# EAGLE design armstrap_eagle-tester_1.0.0 (EAGLE 6.6.0)
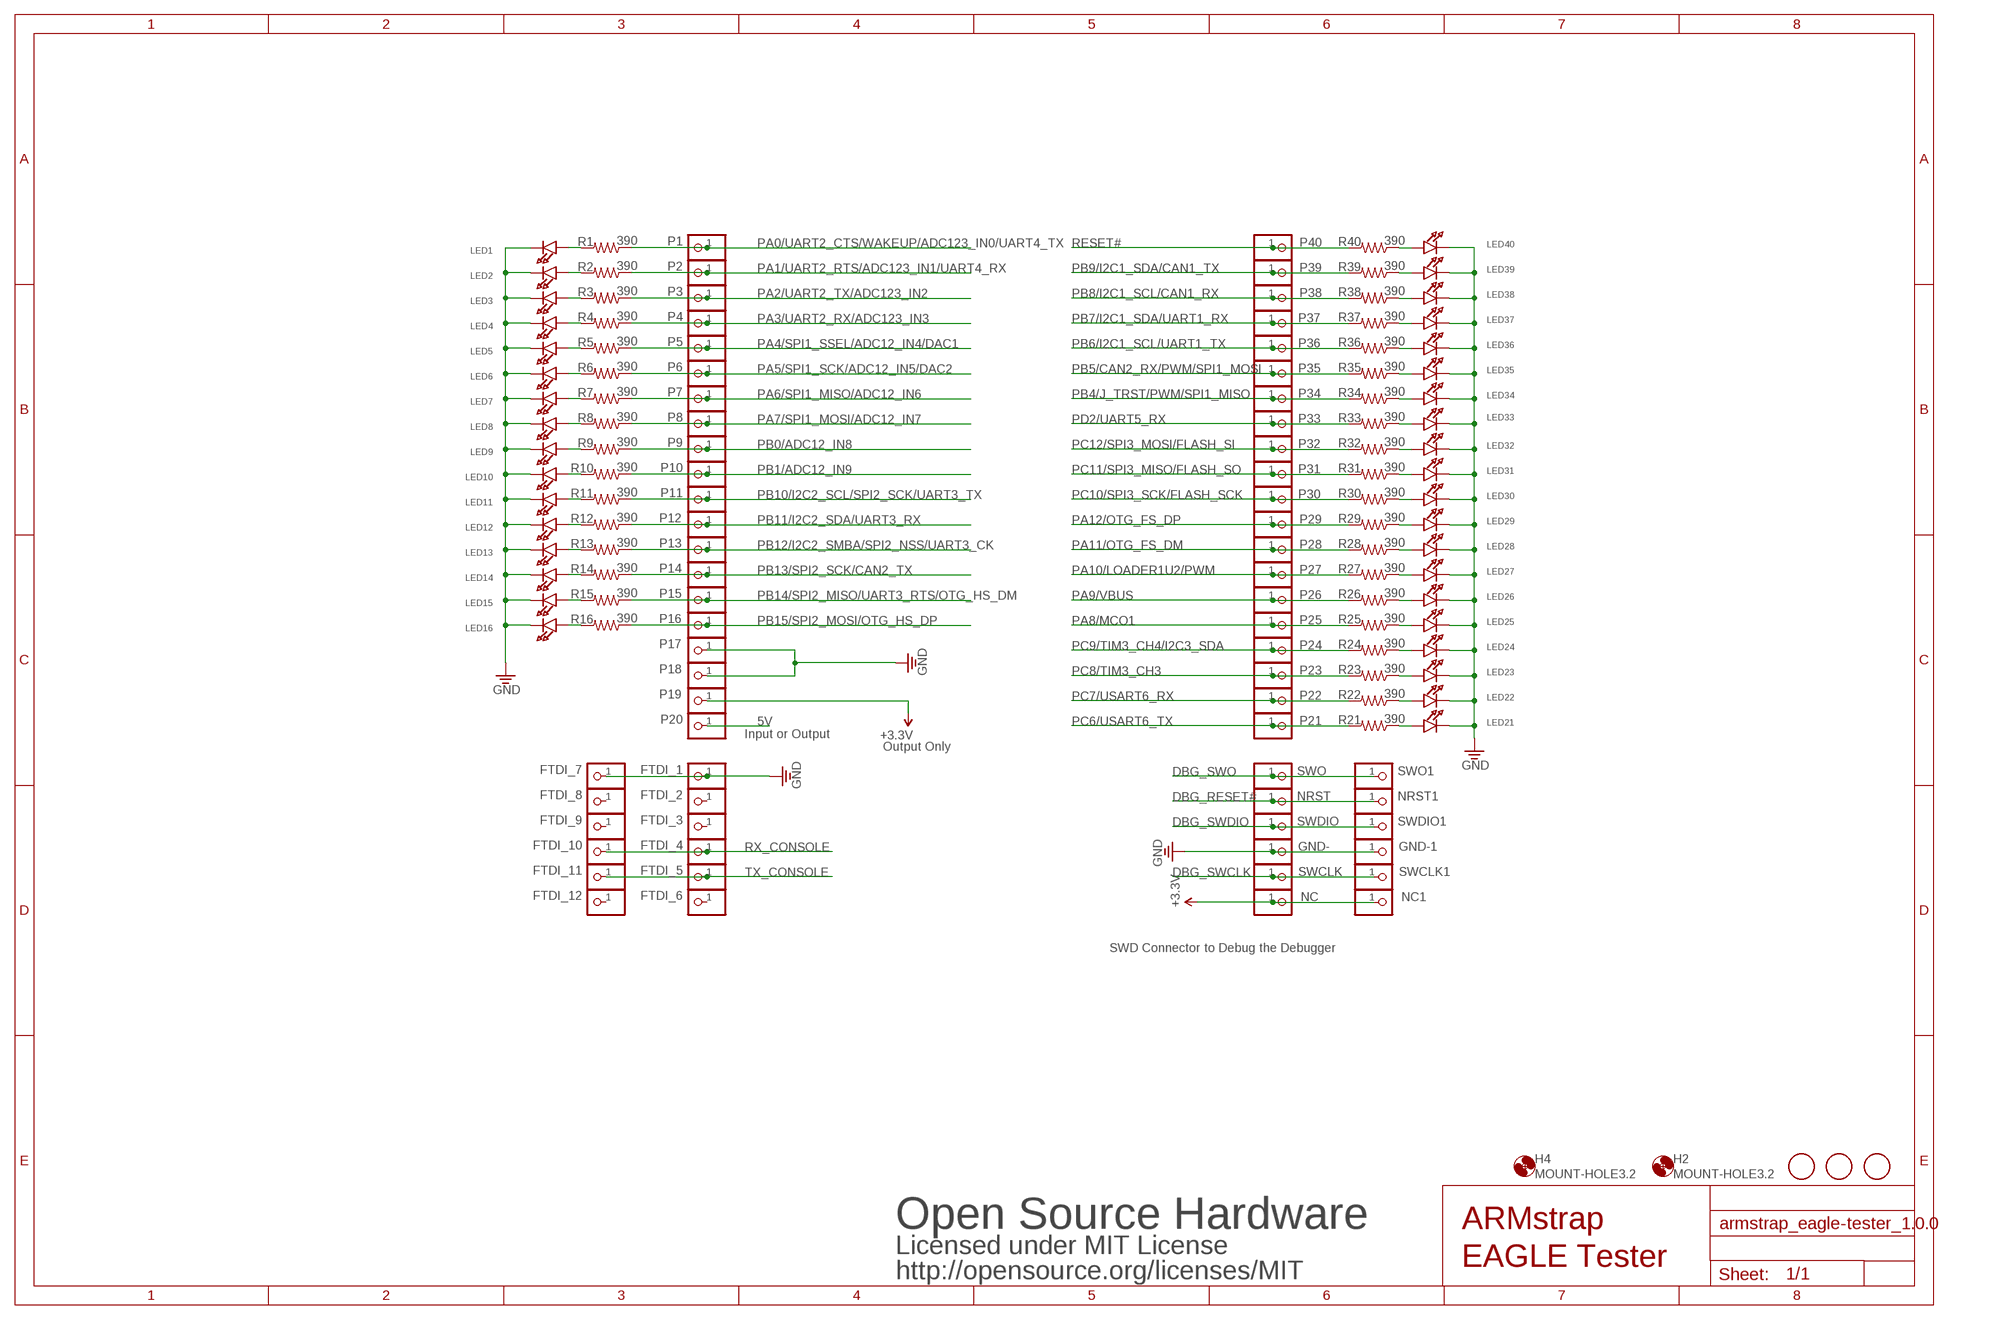
[diagram p0: schematic, sheet 1]

## Parts
FID2  FIDUCIAL  [FIDUCIAL_1MM]
FID3  FIDUCIAL  [FIDUCIAL_1MM]
FID4  FIDUCIAL  [FIDUCIAL_1MM]
FTDI_1  PINHD-1X1  [1X01]
FTDI_2  PINHD-1X1  [1X01]
FTDI_3  PINHD-1X1  [1X01]
FTDI_4  PINHD-1X1  [1X01]
FTDI_5  PINHD-1X1  [1X01]
FTDI_6  PINHD-1X1  [1X01]
FTDI_7  PINHD-1X1  [1X01]
FTDI_8  PINHD-1X1  [1X01]
FTDI_9  PINHD-1X1  [1X01]
FTDI_10  PINHD-1X1  [1X01]
FTDI_11  PINHD-1X1  [1X01]
FTDI_12  PINHD-1X1  [1X01]
GND-  PINHD-1X1  [1X01]
GND-1  PINHD-1X1  [1X01]
H2  MOUNT-HOLE3.2  [3,2]
H4  MOUNT-HOLE3.2  [3,2]
LED1  APT3216QBC/D  LED1206  [CHIPLED_1206]
LED2  APT3216QBC/D  LED1206  [CHIPLED_1206]
LED3  APT3216QBC/D  LED1206  [CHIPLED_1206]
LED4  APT3216QBC/D  LED1206  [CHIPLED_1206]
LED5  APT3216QBC/D  LED1206  [CHIPLED_1206]
LED6  APT3216QBC/D  LED1206  [CHIPLED_1206]
LED7  APT3216QBC/D  LED1206  [CHIPLED_1206]
LED8  APT3216QBC/D  LED1206  [CHIPLED_1206]
LED9  APT3216QBC/D  LED1206  [CHIPLED_1206]
LED10  APT3216QBC/D  LED1206  [CHIPLED_1206]
LED11  APT3216QBC/D  LED1206  [CHIPLED_1206]
LED12  APT3216QBC/D  LED1206  [CHIPLED_1206]
LED13  APT3216QBC/D  LED1206  [CHIPLED_1206]
LED14  APT3216QBC/D  LED1206  [CHIPLED_1206]
LED15  APT3216QBC/D  LED1206  [CHIPLED_1206]
LED16  APT3216QBC/D  LED1206  [CHIPLED_1206]
LED21  APT3216QBC/D  LED1206  [CHIPLED_1206]
LED22  APT3216QBC/D  LED1206  [CHIPLED_1206]
LED23  APT3216QBC/D  LED1206  [CHIPLED_1206]
LED24  APT3216QBC/D  LED1206  [CHIPLED_1206]
LED25  APT3216QBC/D  LED1206  [CHIPLED_1206]
LED26  APT3216QBC/D  LED1206  [CHIPLED_1206]
LED27  APT3216QBC/D  LED1206  [CHIPLED_1206]
LED28  APT3216QBC/D  LED1206  [CHIPLED_1206]
LED29  APT3216QBC/D  LED1206  [CHIPLED_1206]
LED30  APT3216QBC/D  LED1206  [CHIPLED_1206]
LED31  APT3216QBC/D  LED1206  [CHIPLED_1206]
LED32  APT3216QBC/D  LED1206  [CHIPLED_1206]
LED33  APT3216QBC/D  LED1206  [CHIPLED_1206]
LED34  APT3216QBC/D  LED1206  [CHIPLED_1206]
LED35  APT3216QBC/D  LED1206  [CHIPLED_1206]
LED36  APT3216QBC/D  LED1206  [CHIPLED_1206]
LED37  APT3216QBC/D  LED1206  [CHIPLED_1206]
LED38  APT3216QBC/D  LED1206  [CHIPLED_1206]
LED39  APT3216QBC/D  LED1206  [CHIPLED_1206]
LED40  APT3216QBC/D  LED1206  [CHIPLED_1206]
NC  PINHD-1X1  [1X01]
NC1  PINHD-1X1  [1X01]
NRST  PINHD-1X1  [1X01]
NRST1  PINHD-1X1  [1X01]
P1  PINHD-1X1  [1X01]
P2  PINHD-1X1  [1X01]
P3  PINHD-1X1  [1X01]
P4  PINHD-1X1  [1X01]
P5  PINHD-1X1  [1X01]
P6  PINHD-1X1  [1X01]
P7  PINHD-1X1  [1X01]
P8  PINHD-1X1  [1X01]
P9  PINHD-1X1  [1X01]
P10  PINHD-1X1  [1X01]
P11  PINHD-1X1  [1X01]
P12  PINHD-1X1  [1X01]
P13  PINHD-1X1  [1X01]
P14  PINHD-1X1  [1X01]
P15  PINHD-1X1  [1X01]
P16  PINHD-1X1  [1X01]
P17  PINHD-1X1  [1X01]
P18  PINHD-1X1  [1X01]
P19  PINHD-1X1  [1X01]
P20  PINHD-1X1  [1X01]
P21  PINHD-1X1  [1X01]
P22  PINHD-1X1  [1X01]
P23  PINHD-1X1  [1X01]
P24  PINHD-1X1  [1X01]
P25  PINHD-1X1  [1X01]
P26  PINHD-1X1  [1X01]
P27  PINHD-1X1  [1X01]
P28  PINHD-1X1  [1X01]
P29  PINHD-1X1  [1X01]
P30  PINHD-1X1  [1X01]
P31  PINHD-1X1  [1X01]
P32  PINHD-1X1  [1X01]
P33  PINHD-1X1  [1X01]
P34  PINHD-1X1  [1X01]
P35  PINHD-1X1  [1X01]
P36  PINHD-1X1  [1X01]
P37  PINHD-1X1  [1X01]
P38  PINHD-1X1  [1X01]
P39  PINHD-1X1  [1X01]
P40  PINHD-1X1  [1X01]
R1  390  RES0805  [0805]
R2  390  RES0805  [0805]
R3  390  RES0805  [0805]
R4  390  RES0805  [0805]
R5  390  RES0805  [0805]
R6  390  RES0805  [0805]
R7  390  RES0805  [0805]
R8  390  RES0805  [0805]
R9  390  RES0805  [0805]
R10  390  RES0805  [0805]
R11  390  RES0805  [0805]
R12  390  RES0805  [0805]
R13  390  RES0805  [0805]
R14  390  RES0805  [0805]
R15  390  RES0805  [0805]
R16  390  RES0805  [0805]
R21  390  RES0805  [0805]
R22  390  RES0805  [0805]
R23  390  RES0805  [0805]
R24  390  RES0805  [0805]
R25  390  RES0805  [0805]
R26  390  RES0805  [0805]
R27  390  RES0805  [0805]
R28  390  RES0805  [0805]
R29  390  RES0805  [0805]
R30  390  RES0805  [0805]
R31  390  RES0805  [0805]
R32  390  RES0805  [0805]
R33  390  RES0805  [0805]
R34  390  RES0805  [0805]
R35  390  RES0805  [0805]
R36  390  RES0805  [0805]
R37  390  RES0805  [0805]
R38  390  RES0805  [0805]
R39  390  RES0805  [0805]
R40  390  RES0805  [0805]
SWCLK  PINHD-1X1  [1X01]
SWCLK1  PINHD-1X1  [1X01]
SWDIO  PINHD-1X1  [1X01]
SWDIO1  PINHD-1X1  [1X01]
SWO  PINHD-1X1  [1X01]
SWO1  PINHD-1X1  [1X01]

## Nets
3.3V: NC1.1 NC.1 P19.1 ; supply symbol labelled +3.3V
5: LED5.A R5.2
5V: P20.1
11: LED11.A R11.2
DBG_RESET#: NRST1.1 NRST.1
DBG_SWCLK: SWCLK1.1 SWCLK.1
DBG_SWDIO: SWDIO1.1 SWDIO.1
DBG_SWO: SWO1.1 SWO.1
E2: LED2.A R2.2
GND [power]: FTDI_1.1 FTDI_7.1 GND-1.1 GND-.1 LED1.C LED2.C LED3.C LED4.C LED5.C LED6.C LED7.C LED8.C LED9.C LED10.C LED11.C LED12.C LED13.C LED14.C LED15.C LED16.C LED21.C LED22.C LED23.C LED24.C LED25.C LED26.C LED27.C LED28.C LED29.C LED30.C LED31.C LED32.C LED33.C LED34.C LED35.C LED36.C LED37.C LED38.C LED39.C LED40.C P17.1 P18.1
N$1: LED1.A R1.2
N$3: LED3.A R3.2
N$4: LED4.A R4.2
N$8: LED6.A R6.2
N$9: LED7.A R7.2
N$10: LED8.A R8.2
N$11: LED9.A R9.2
N$12: LED10.A R10.2
N$14: LED12.A R12.2
N$15: LED13.A R13.2
N$16: LED14.A R14.2
N$17: LED15.A R15.2
N$18: LED16.A R16.2
N$21: LED40.A R40.1
N$22: LED39.A R39.1
N$23: LED38.A R38.1
N$25: LED37.A R37.1
N$26: LED36.A R36.1
N$27: LED35.A R35.1
N$28: LED34.A R34.1
N$29: LED33.A R33.1
N$30: LED32.A R32.1
N$31: LED31.A R31.1
N$32: LED30.A R30.1
N$33: LED29.A R29.1
N$34: LED28.A R28.1
N$35: LED27.A R27.1
N$36: LED26.A R26.1
N$37: LED25.A R25.1
N$38: LED24.A R24.1
N$39: LED23.A R23.1
N$40: LED22.A R22.1
N$41: LED21.A R21.1
PA0/UART2_CTS/WAKEUP/ADC123_IN0/UART4_TX: P1.1 R1.1
PA1/UART2_RTS/ADC123_IN1/UART4_RX: P2.1 R2.1
PA2/UART2_TX/ADC123_IN2: P3.1 R3.1
PA3/UART2_RX/ADC123_IN3: P4.1 R4.1
PA4/SPI1_SSEL/ADC12_IN4/DAC1: P5.1 R5.1
PA5/SPI1_SCK/ADC12_IN5/DAC2: P6.1 R6.1
PA6/SPI1_MISO/ADC12_IN6: P7.1 R7.1
PA7/SPI1_MOSI/ADC12_IN7: P8.1 R8.1
PA8/MCO1: P25.1 R25.2
PA9/VBUS: P26.1 R26.2
PA10/LOADER1U2/PWM: P27.1 R27.2
PA11/OTG_FS_DM: P28.1 R28.2
PA12/OTG_FS_DP: P29.1 R29.2
PB0/ADC12_IN8: P9.1 R9.1
PB1/ADC12_IN9: P10.1 R10.1
PB4/J_TRST/PWM/SPI1_MISO: P34.1 R34.2
PB5/CAN2_RX/PWM/SPI1_MOSI: P35.1 R35.2
PB6/I2C1_SCL/UART1_TX: P36.1 R36.2
PB7/I2C1_SDA/UART1_RX: P37.1 R37.2
PB8/I2C1_SCL/CAN1_RX: P38.1 R38.2
PB9/I2C1_SDA/CAN1_TX: P39.1 R39.2
PB10/I2C2_SCL/SPI2_SCK/UART3_TX: P11.1 R11.1
PB11/I2C2_SDA/UART3_RX: P12.1 R12.1
PB12/I2C2_SMBA/SPI2_NSS/UART3_CK: P13.1 R13.1
PB13/SPI2_SCK/CAN2_TX: P14.1 R14.1
PB14/SPI2_MISO/UART3_RTS/OTG_HS_DM: P15.1 R15.1
PB15/SPI2_MOSI/OTG_HS_DP: P16.1 R16.1
PC6/USART6_TX: P21.1 R21.2
PC7/USART6_RX: P22.1 R22.2
PC8/TIM3_CH3: P23.1 R23.2
PC9/TIM3_CH4/I2C3_SDA: P24.1 R24.2
PC10/SPI3_SCK/FLASH_SCK: P30.1 R30.2
PC11/SPI3_MISO/FLASH_SO: P31.1 R31.2
PC12/SPI3_MOSI/FLASH_SI: P32.1 R32.2
PD2/UART5_RX: P33.1 R33.2
RESET#: P40.1 R40.2
RX_CONSOLE: FTDI_4.1 FTDI_10.1
TX_CONSOLE: FTDI_5.1 FTDI_11.1
Unconnected: FTDI_2.1 FTDI_3.1 FTDI_6.1 FTDI_8.1 FTDI_9.1 FTDI_12.1

## Notes on the sheet
- Input or Output
- Output Only
- SWD Connector to Debug the Debugger
- Open Source Hardware | ARMstrap
- Licensed under MIT License
- EAGLE Tester
- http://opensource.org/licenses/MIT

## Library data of the parts
FID2-FID4 = vovtech:FIDUCIAL: For use by pick and place machines to calibrate the vision/machine, 1mm By microbuilder.eu
FTDI_1-FTDI_12 GND- GND-1 NC NC1 NRST NRST1 P1-P40 SWCLK SWCLK1 SWDIO SWDIO1 SWO SWO1 = pinhead:PINHD-1X1: PIN HEADER
H2 H4 = vovtech:MOUNT-HOLE: MOUNTING HOLE with drill center marker
LED1-LED16 LED21-LED40 = vovtech:LED: LED 0603 - 0603 Surface Mount Package Green LED - Low Power (3.9mcd, 2ma, 1.7Vf) Orange LED - Low Power (9.8mcd, 2ma, 1.8Vf) Red LED - Low Power (5mcd, 2ma, 1.8Vf) Yellow LED - Low Power (7mcd, 2ma, 1.8Vf) 0805 - 0805 Surface Mount Package 20mA: Red LED (104mcd, 20mA, Diffused) - LS R976 [Digikey: 475-1278-6-ND] Red LED (12mcd, 20mA, 2.0Vf, Clear) - APT2012EC [Digikey: 754-1128-1-ND] Green LED (15mcd, 20mA, 2.2Vf, Clear) - APT2012GC [Digikey: 754-1131-1-ND] Orange LED (160mcd, 20mA, 2.1Vf, Clear) - APT2012SECK [Digikey: 754-1130-1-ND] 2mA: Red LED (8.8mcd, 2mA, 1.8Vf, Clear) - Low Power [Digikey: 475-2510-1-ND] Green LED (5mcd, 2mA, 1.8Vf, Clear) - Low Power [Digikey: 475-2730-1-ND] Yellow LED (11.3mcd, 2mA, 1.8Vf, Clear) - Low Power [Digikey: 475-2555-1-ND] 1206 - 1206 Surface Mount Package Green LED (26mcd, 20mA, Diffused) - LG N971 [Digikey: 475-1407-6-ND] Red LED (15mcd, 20mA, Diffused) - LH N974 [Digikey: 475-1416-6-ND]
R1-R16 R21-R40 = vovtech:RES: Resistor

## Board
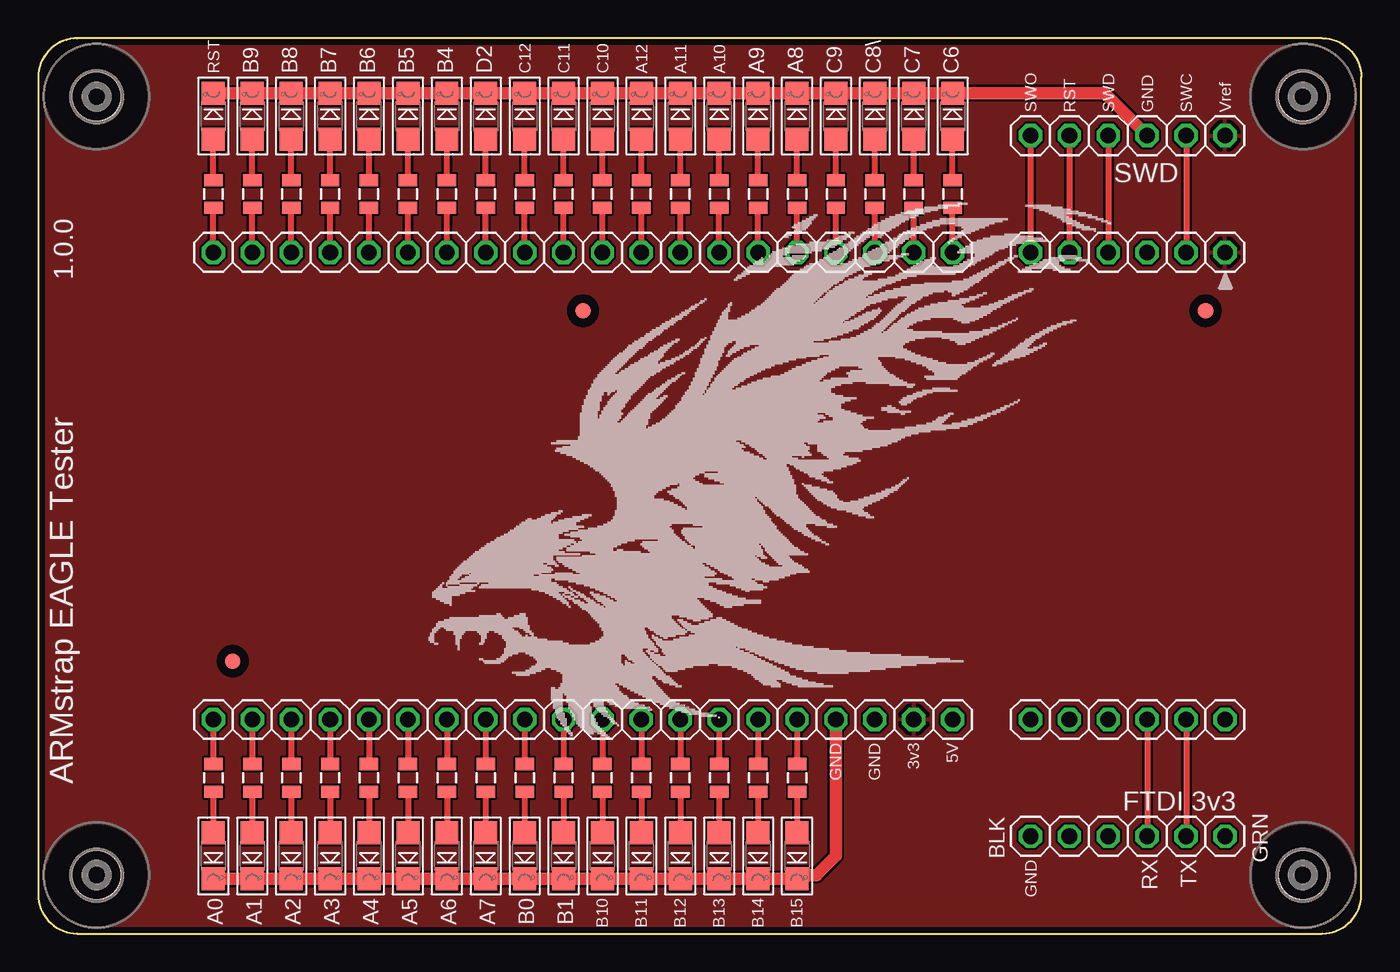
[diagram p1: board, top side]
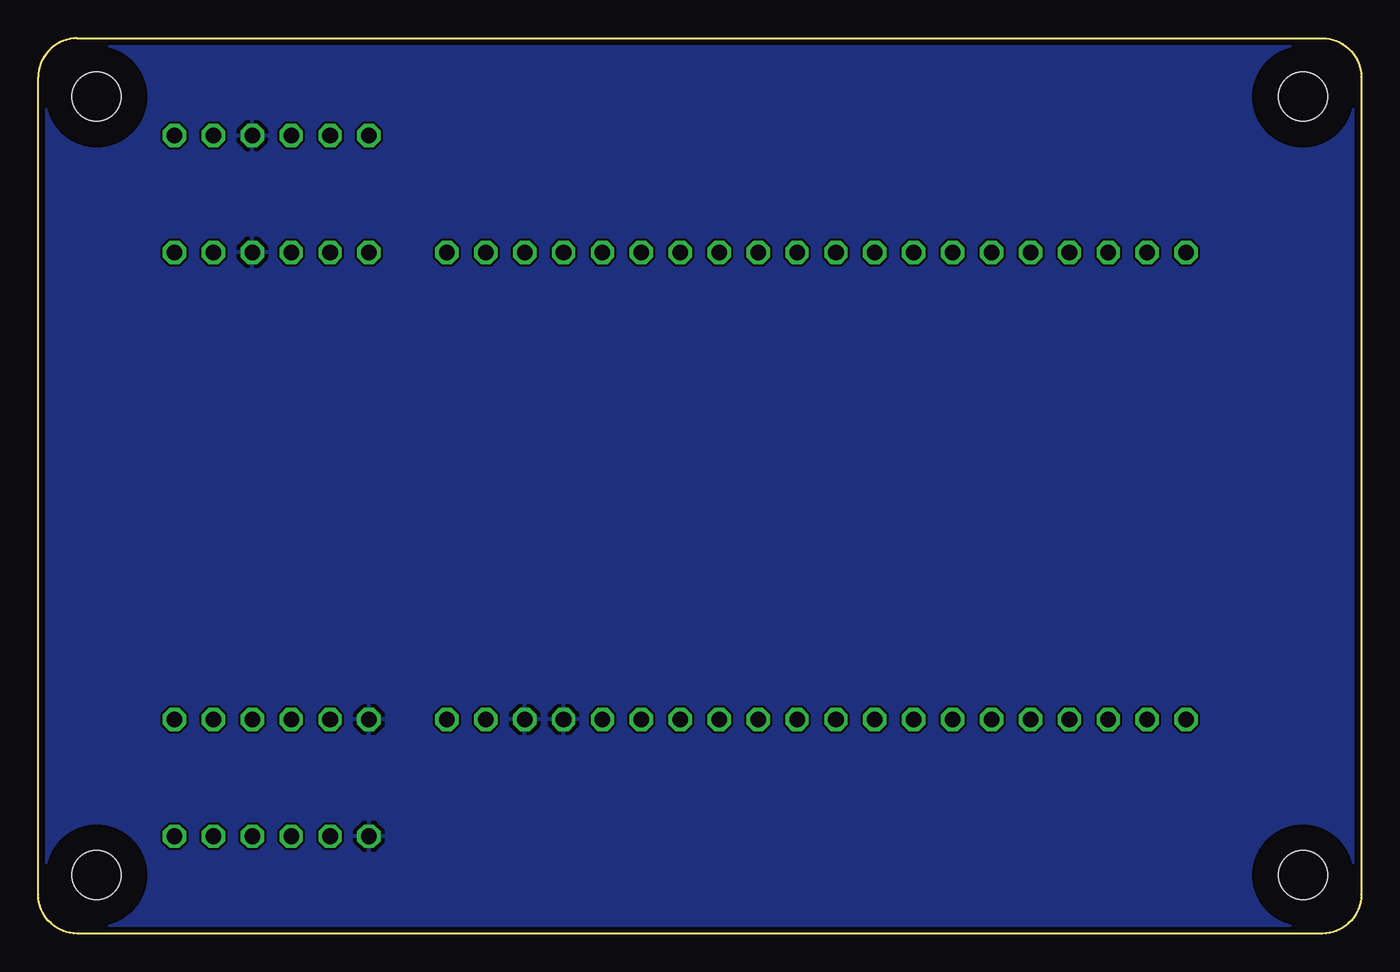
[diagram p2: board, bottom side, seen from below]

Size 86.36 x 58.42 mm. Coordinates in mm from the lower left corner, seen from the top.
Outline: 2.54,0 83.82,0 arc90 86.36,2.54 86.36,55.88 arc90 83.82,58.42 2.54,58.42 arc90 0,55.88 0,2.54 arc90 2.54,0
Copper layers (1*16): Top 0.0356mm / dielectric 1.5011mm / Bottom 0.0356mm
Design rules "LaenPCBOrder *": minimum track width 6mil, minimum drill 13mil, track to track 6mil, track to pad 6mil, pad to pad 6mil, via to via 6mil, smd to smd 6mil, copper to edge 15mil, drill to drill 6mil, minimum pad ring 7mil, minimum via ring 7mil, stop-mask expansion 4mil, vias tented up to drill 16mil, thermal gap 10mil

### Footprints (pad centres in the part's own frame; a part is rotated, then mirrored left to right if it is on the bottom)
FIDUCIAL_1MM = smd 1 x 1: 1 0,0
1X01 = drill 1.016 octagon: 1 0,0
3,2 = hole 3.2: 0,0
CHIPLED_1206 = smd 1.5 x 1.5: A 1.496,0; C -1.496,0
0805 = smd 0.8 x 1.2: 1 -0.9,0; 2 0.9,0

### Placement (x,y rotation side)
FID2  76.2,40.64 0 top
FID3  12.7,17.78 0 top
FID4  35.56,40.64 0 top
FTDI_1  64.77,13.97 0 top
FTDI_2  67.31,13.97 0 top
FTDI_3  69.85,13.97 0 top
FTDI_4  72.39,13.97 0 top
FTDI_5  74.93,13.97 0 top
FTDI_6  77.47,13.97 0 top
FTDI_7  64.77,6.35 90 top
FTDI_8  67.31,6.35 90 top
FTDI_9  69.85,6.35 90 top
FTDI_10  72.39,6.35 90 top
FTDI_11  74.93,6.35 90 top
FTDI_12  77.47,6.35 90 top
GND-  72.39,44.45 0 top
GND-1  72.39,52.07 90 top
H1  MOUNT-HOLE3.2  [3,2]  82.55,54.61 0 top
H2  82.55,3.81 0 top
H3  MOUNT-HOLE3.2  [3,2]  3.81,54.61 0 top
H4  3.81,3.81 0 top
LED1  11.43,5.08 90 top
LED2  13.97,5.08 90 top
LED3  16.51,5.08 90 top
LED4  19.05,5.08 90 top
LED5  21.59,5.08 90 top
LED6  24.13,5.08 90 top
LED7  26.67,5.08 90 top
LED8  29.21,5.08 90 top
LED9  31.75,5.08 90 top
LED10  34.29,5.08 90 top
LED11  36.83,5.08 90 top
LED12  39.37,5.08 90 top
LED13  41.91,5.08 90 top
LED14  44.45,5.08 90 top
LED15  46.99,5.08 90 top
LED16  49.53,5.08 90 top
LED21  59.69,53.34 270 top
LED22  57.15,53.34 270 top
LED23  54.61,53.34 270 top
LED24  52.07,53.34 270 top
LED25  49.53,53.34 270 top
LED26  46.99,53.34 270 top
LED27  44.45,53.34 270 top
LED28  41.91,53.34 270 top
LED29  39.37,53.34 270 top
LED30  36.83,53.34 270 top
LED31  34.29,53.34 270 top
LED32  31.75,53.34 270 top
LED33  29.21,53.34 270 top
LED34  26.67,53.34 270 top
LED35  24.13,53.34 270 top
LED36  21.59,53.34 270 top
LED37  19.05,53.34 270 top
LED38  16.51,53.34 270 top
LED39  13.97,53.34 270 top
LED40  11.43,53.34 270 top
NC  77.47,44.45 0 top
NC1  77.47,52.07 90 top
NRST  67.31,44.45 0 top
NRST1  67.31,52.07 90 top
P1  11.43,13.97 0 top
P2  13.97,13.97 90 top
P3  16.51,13.97 90 top
P4  19.05,13.97 90 top
P5  21.59,13.97 90 top
P6  24.13,13.97 90 top
P7  26.67,13.97 90 top
P8  29.21,13.97 90 top
P9  31.75,13.97 90 top
P10  34.29,13.97 90 top
P11  36.83,13.97 90 top
P12  39.37,13.97 90 top
P13  41.91,13.97 90 top
P14  44.45,13.97 90 top
P15  46.99,13.97 90 top
P16  49.53,13.97 90 top
P17  52.07,13.97 90 top
P18  54.61,13.97 90 top
P19  57.15,13.97 90 top
P20  59.69,13.97 90 top
P21  59.69,44.45 0 top
P22  57.15,44.45 0 top
P23  54.61,44.45 0 top
P24  52.07,44.45 0 top
P25  49.53,44.45 0 top
P26  46.99,44.45 0 top
P27  44.45,44.45 0 top
P28  41.91,44.45 0 top
P29  39.37,44.45 0 top
P30  36.83,44.45 0 top
P31  34.29,44.45 0 top
P32  31.75,44.45 0 top
P33  29.21,44.45 0 top
P34  26.67,44.45 0 top
P35  24.13,44.45 0 top
P36  21.59,44.45 0 top
P37  19.05,44.45 0 top
P38  16.51,44.45 0 top
P39  13.97,44.45 0 top
P40  11.43,44.45 0 top
R1  11.43,10.16 270 top
R2  13.97,10.16 270 top
R3  16.51,10.16 270 top
R4  19.05,10.16 270 top
R5  21.59,10.16 270 top
R6  24.13,10.16 270 top
R7  26.67,10.16 270 top
R8  29.21,10.16 270 top
R9  31.75,10.16 270 top
R10  34.29,10.16 270 top
R11  36.83,10.16 270 top
R12  39.37,10.16 270 top
R13  41.91,10.16 270 top
R14  44.45,10.16 270 top
R15  46.99,10.16 270 top
R16  49.53,10.16 270 top
R21  59.69,48.26 270 top
R22  57.15,48.26 270 top
R23  54.61,48.26 270 top
R24  52.07,48.26 270 top
R25  49.53,48.26 270 top
R26  46.99,48.26 270 top
R27  44.45,48.26 270 top
R28  41.91,48.26 270 top
R29  39.37,48.26 270 top
R30  36.83,48.26 270 top
R31  34.29,48.26 270 top
R32  31.75,48.26 270 top
R33  29.21,48.26 270 top
R34  26.67,48.26 270 top
R35  24.13,48.26 270 top
R36  21.59,48.26 270 top
R37  19.05,48.26 270 top
R38  16.51,48.26 270 top
R39  13.97,48.26 270 top
R40  11.43,48.26 270 top
SWCLK  74.93,44.45 0 top
SWCLK1  74.93,52.07 90 top
SWDIO  69.85,44.45 0 top
SWDIO1  69.85,52.07 90 top
SWO  64.77,44.45 0 top
SWO1  64.77,52.07 0 top

### Tracks (layer width: path | path; a pad name or v marks a point on that pad's centre or on a via)
3.3V
  pour Top: -0.76,59.69 86.11,59.69 86.11,-1.27 0,-1.27
5
  Top 0.406: R5.2 LED5.A
11
  Top 0.406: R11.2 LED11.A
DBG_RESET#
  Top 0.406: NRST1.1 NRST.1
DBG_SWCLK
  Top 0.406: SWCLK1.1 SWCLK.1
DBG_SWDIO
  Top 0.406: SWDIO1.1 SWDIO.1
DBG_SWO
  Top 0.203: SWO.1 64.74,44.42
  Top 0.406: SWO1.1 SWO.1
E2
  Top 0.406: R2.2 LED2.A
GND
  Top 0.813: LED1.C LED2.C LED3.C LED4.C LED5.C LED6.C LED7.C LED8.C LED9.C LED10.C LED11.C LED12.C LED13.C LED14.C LED15.C LED16.C 49.76,3.81 50.8,3.81 52.07,5.08 P17.1 | LED40.C LED39.C LED38.C LED37.C LED36.C LED35.C LED34.C LED33.C LED32.C LED31.C LED30.C LED29.C LED28.C LED27.C LED26.C LED25.C LED24.C LED23.C LED22.C LED21.C 69.62,54.84 GND-1.1
  pour Bottom (rank 2): 86.41,59.23 86.41,-0.41 0.2,-0.41 0.2,59.23
N$1
  Top 0.406: R1.2 LED1.A
N$3
  Top 0.406: R3.2 LED3.A
N$4
  Top 0.406: R4.2 LED4.A
N$8
  Top 0.406: R6.2 LED6.A
N$9
  Top 0.406: R7.2 LED7.A
N$10
  Top 0.406: R8.2 LED8.A
N$11
  Top 0.406: R9.2 LED9.A
N$12
  Top 0.406: R10.2 LED10.A
N$14
  Top 0.406: R12.2 LED12.A
N$15
  Top 0.406: R13.2 LED13.A
N$16
  Top 0.406: R14.2 LED14.A
N$17
  Top 0.406: R15.2 LED15.A
N$18
  Top 0.406: R16.2 LED16.A
N$21
  Top 0.406: R40.1 LED40.A
N$22
  Top 0.406: R39.1 LED39.A
N$23
  Top 0.406: R38.1 LED38.A
N$25
  Top 0.406: R37.1 LED37.A
N$26
  Top 0.406: R36.1 LED36.A
N$27
  Top 0.406: R35.1 LED35.A
N$28
  Top 0.406: R34.1 LED34.A
N$29
  Top 0.406: R33.1 LED33.A
N$30
  Top 0.406: R32.1 LED32.A
N$31
  Top 0.406: R31.1 LED31.A
N$32
  Top 0.406: R30.1 LED30.A
N$33
  Top 0.406: R29.1 LED29.A
N$34
  Top 0.406: R28.1 LED28.A
N$35
  Top 0.406: R27.1 LED27.A
N$36
  Top 0.406: R26.1 LED26.A
N$37
  Top 0.406: R25.1 LED25.A
N$38
  Top 0.406: R24.1 LED24.A
N$39
  Top 0.406: R23.1 LED23.A
N$40
  Top 0.406: R22.1 LED22.A
N$41
  Top 0.406: R21.1 LED21.A
PA0/UART2_CTS/WAKEUP/ADC123_IN0/UART4_TX
  Top 0.406: P1.1 R1.1
PA1/UART2_RTS/ADC123_IN1/UART4_RX
  Top 0.203: P2.1
  Top 0.406: P2.1 R2.1
PA2/UART2_TX/ADC123_IN2
  Top 0.406: P3.1 R3.1
PA3/UART2_RX/ADC123_IN3
  Top 0.203: 19.03,13.99 P4.1
  Top 0.406: P4.1 R4.1
PA4/SPI1_SSEL/ADC12_IN4/DAC1
  Top 0.406: P5.1 R5.1
PA5/SPI1_SCK/ADC12_IN5/DAC2
  Top 0.406: P6.1 R6.1
PA6/SPI1_MISO/ADC12_IN6
  Top 0.406: P7.1 R7.1
PA7/SPI1_MOSI/ADC12_IN7
  Top 0.406: P8.1 R8.1
PA8/MCO1
  Top 0.406: P25.1 R25.2
PA9/VBUS
  Top 0.406: P26.1 R26.2
PA10/LOADER1U2/PWM
  Top 0.406: P27.1 R27.2
PA11/OTG_FS_DM
  Top 0.406: P28.1 R28.2
PA12/OTG_FS_DP
  Top 0.406: P29.1 R29.2
PB0/ADC12_IN8
  Top 0.406: P9.1 R9.1
PB1/ADC12_IN9
  Top 0.406: P10.1 R10.1
PB4/J_TRST/PWM/SPI1_MISO
  Top 0.406: P34.1 R34.2
PB5/CAN2_RX/PWM/SPI1_MOSI
  Top 0.406: P35.1 R35.2
PB6/I2C1_SCL/UART1_TX
  Top 0.406: P36.1 R36.2
PB7/I2C1_SDA/UART1_RX
  Top 0.406: P37.1 R37.2
PB8/I2C1_SCL/CAN1_RX
  Top 0.406: P38.1 R38.2
PB9/I2C1_SDA/CAN1_TX
  Top 0.406: P39.1 R39.2
PB10/I2C2_SCL/SPI2_SCK/UART3_TX
  Top 0.406: P11.1 R11.1
PB11/I2C2_SDA/UART3_RX
  Top 0.203: 39.29,14.05 P12.1
  Top 0.406: P12.1 R12.1
PB12/I2C2_SMBA/SPI2_NSS/UART3_CK
  Top 0.406: P13.1 R13.1
PB13/SPI2_SCK/CAN2_TX
  Top 0.406: P14.1 R14.1
PB14/SPI2_MISO/UART3_RTS/OTG_HS_DM
  Top 0.406: P15.1 R15.1
PB15/SPI2_MOSI/OTG_HS_DP
  Top 0.406: P16.1 R16.1
PC6/USART6_TX
  Top 0.406: P21.1 R21.2
PC7/USART6_RX
  Top 0.406: P22.1 R22.2
PC8/TIM3_CH3
  Top 0.406: P23.1 R23.2
PC9/TIM3_CH4/I2C3_SDA
  Top 0.406: P24.1 R24.2
PC10/SPI3_SCK/FLASH_SCK
  Top 0.406: P30.1 R30.2
PC11/SPI3_MISO/FLASH_SO
  Top 0.406: P31.1 R31.2
PC12/SPI3_MOSI/FLASH_SI
  Top 0.406: P32.1 R32.2
PD2/UART5_RX
  Top 0.406: P33.1 R33.2
RESET#
  Top 0.406: P40.1 R40.2
RX_CONSOLE
  Top 0.406: FTDI_4.1 FTDI_10.1
TX_CONSOLE
  Top 0.406: FTDI_5.1 FTDI_11.1

### Text on the board
_tsilk: RST | B9 | B8 | B7 | B6 | B5 | B4 | D2 | C12 | C11 | C10 | A12 | A11 | A10 | A9 | A8 | C9 | C8\ | C7 | C6 | SWO | RST | SWD | GND | SWC | Vref | SWD | 1.0.0 | GND | GND | 3v3 | 5V | ARMstrap EAGLE Tester | FTDI 3v3 | BLK | GRN | GND | RX | TX | A0 | A1 | A2 | A3 | A4 | A5 | A6 | A7 | B0 | B1 | B10 | B11 | B12 | B13 | B14 | B15